# EAGLE design Line Tracer SET (EAGLE 7.6.0)
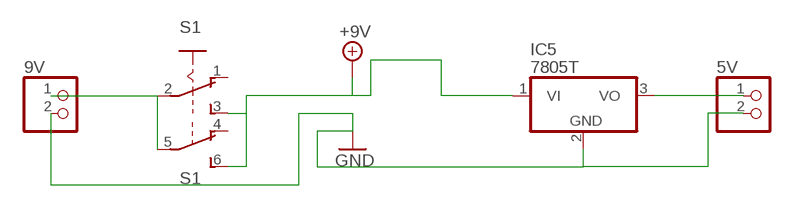
[diagram p0: schematic, sheet 1, part 1 of 2]
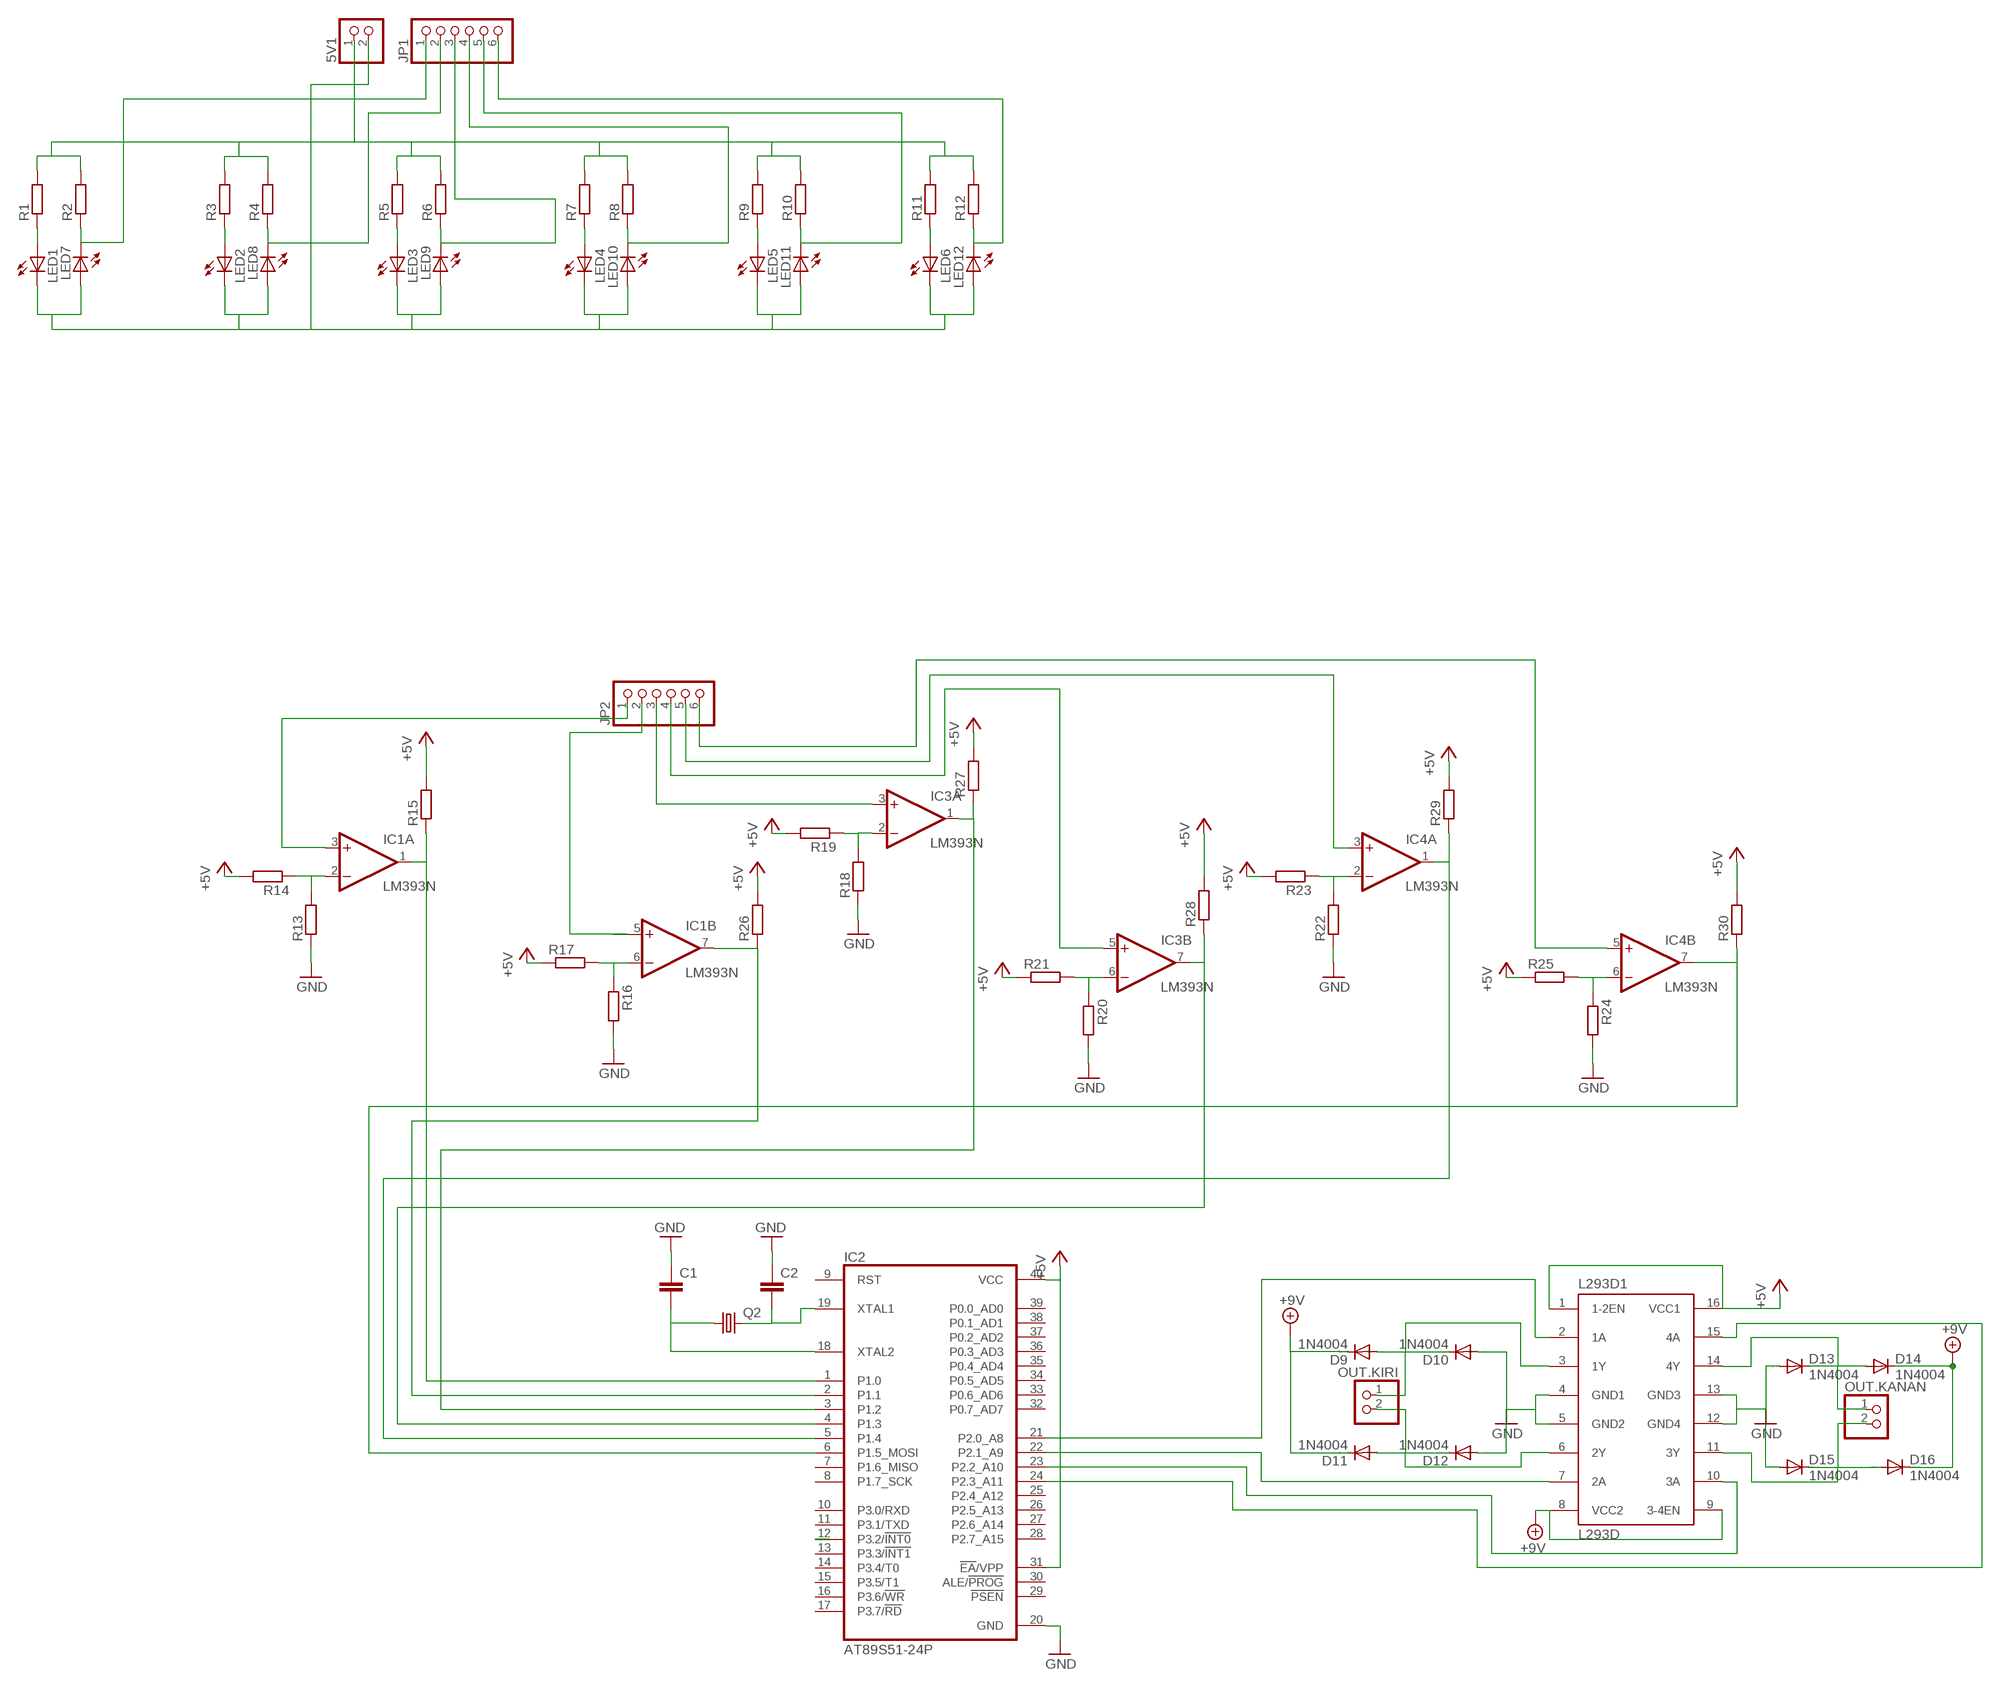
[diagram p1: schematic, sheet 1, part 2 of 2]

## Parts
5V  PINHD-1X2  [1X02]
5V1  PINHD-1X2  [1X02]
9V  PINHD-1X2  [1X02]
C1  C-EU025-024X044  [C025-024X044]
C2  C-EU025-024X044  [C025-024X044]
D9  1N4004  [DO41-10]
D10  1N4004  [DO41-10]
D11  1N4004  [DO41-10]
D12  1N4004  [DO41-10]
D13  1N4004  [DO41-10]
D14  1N4004  [DO41-10]
D15  1N4004  [DO41-10]
D16  1N4004  [DO41-10]
IC1  LM393N  [DIL08]
IC2  AT89S51-24P  [DIL40]
IC3  LM393N  [DIL08]
IC4  LM393N  [DIL08]
IC5  7805T  [TO220H]
JP1  PINHD-1X6  [1X06]
JP2  PINHD-1X6  [1X06]
L293D1  L293D  [DIL16]
LED1  LED3MM  [LED3MM]
LED2  LED3MM  [LED3MM]
LED3  LED3MM  [LED3MM]
LED4  LED3MM  [LED3MM]
LED5  LED3MM  [LED3MM]
LED6  LED3MM  [LED3MM]
LED7  LED3MM  [LED3MM]
LED8  LED3MM  [LED3MM]
LED9  LED3MM  [LED3MM]
LED10  LED3MM  [LED3MM]
LED11  LED3MM  [LED3MM]
LED12  LED3MM  [LED3MM]
OUT.KANAN  PINHD-1X2  [1X02]
OUT.KIRI  PINHD-1X2  [1X02]
Q2  CRYSTALHC49S  [HC49/S]
R1  R-EU_0207/10  [0207/10]
R2  R-EU_0207/10  [0207/10]
R3  R-EU_0207/10  [0207/10]
R4  R-EU_0207/10  [0207/10]
R5  R-EU_0207/10  [0207/10]
R6  R-EU_0207/10  [0207/10]
R7  R-EU_0207/10  [0207/10]
R8  R-EU_0207/10  [0207/10]
R9  R-EU_0207/10  [0207/10]
R10  R-EU_0207/10  [0207/10]
R11  R-EU_0207/10  [0207/10]
R12  R-EU_0207/10  [0207/10]
R13  R-EU_0207/10  [0207/10]
R14  R-EU_0207/10  [0207/10]
R15  R-EU_0207/10  [0207/10]
R16  R-EU_0207/10  [0207/10]
R17  R-EU_0207/10  [0207/10]
R18  R-EU_0207/10  [0207/10]
R19  R-EU_0207/10  [0207/10]
R20  R-EU_0207/10  [0207/10]
R21  R-EU_0207/10  [0207/10]
R22  R-EU_0207/10  [0207/10]
R23  R-EU_0207/10  [0207/10]
R24  R-EU_0207/10  [0207/10]
R25  R-EU_0207/10  [0207/10]
R26  R-EU_0207/10  [0207/10]
R27  R-EU_0207/10  [0207/10]
R28  R-EU_0207/10  [0207/10]
R29  R-EU_0207/10  [0207/10]
R30  R-EU_0207/10  [0207/10]
S1  A68-A31  [A68-A31]

## Nets
5V: 5V1.1 R1.2 R2.2 R3.2 R4.2 R5.2 R6.2 R7.2 R8.2 R9.2 R10.2 R11.2 R12.2
+5V: IC2.31(!EA!/VPP) IC2.40(VCC) L293D1.1(1-2EN) L293D1.16(VCC1) R14.2 R15.2 R17.1 R19.2 R21.1 R23.2 R25.1 R26.2 R27.2 R28.2 R29.2 R30.2
+9V: D9.C D11.C D14.C D16.C IC5.1(VI) L293D1.8(VCC2) L293D1.9(3-4EN) S1.3(A:S) S1.6(B:S)
GND: 5V.2 9V.2 C1.1 C2.1 D10.A D12.A D13.A D15.A IC2.20(GND) IC5.2(GND) L293D1.4(GND1) L293D1.5(GND2) L293D1.12(GND4) L293D1.13(GND3) R13.1 R16.2 R18.1 R20.2 R22.1 R24.2
GNDS: 5V1.2 LED1.K(C) LED2.K(C) LED3.K(C) LED4.K(C) LED5.K(C) LED6.K(C) LED7.A LED8.A LED9.A LED10.A LED11.A LED12.A
N$1: IC3.3(A:+IN) JP2.3
N$2: LED3.A R5.1
N$3: IC1.2(A:-IN) R13.2 R14.1
N$4: LED4.A R7.1
N$5: IC3.5(B:+IN) JP2.4
N$6: LED5.A R9.1
N$7: JP1.5 LED11.K(C) R10.1
N$8: LED6.A R11.1
N$9: IC4.5(B:+IN) JP2.6
N$10: LED1.A R1.1
N$11: JP1.2 LED8.K(C) R4.1
N$12: LED2.A R3.1
N$13: IC1.6(B:-IN) R16.1 R17.2
N$14: C2.2 IC2.19(XTAL1) Q2.2
N$15: JP1.3 LED9.K(C) R6.1
N$16: C1.2 IC2.18(XTAL2) Q2.1
N$17: IC3.2(A:-IN) R18.2 R19.1
N$18: IC3.6(B:-IN) R20.1 R21.2
N$19: IC4.2(A:-IN) R22.2 R23.1
N$20: IC4.6(B:-IN) R24.1 R25.2
N$21: IC2.12(P3.2/!INT0)
N$22: IC2.21(P2.0_A8) L293D1.2(1A)
N$23: D11.A D12.C L293D1.6(2Y) OUT.KIRI.2
N$24: IC2.3(P1.2) IC3.1(A:OUT) R27.1
N$25: D15.C D16.A L293D1.11(3Y) OUT.KANAN.2
N$26: D13.C D14.A L293D1.14(4Y) OUT.KANAN.1
N$27: IC2.22(P2.1_A9) L293D1.7(2A)
N$28: IC2.23(P2.2_A10) L293D1.10(3A)
N$29: IC2.24(P2.3_A11) L293D1.15(4A)
N$30: IC1.1(A:OUT) IC2.1(P1.0) R15.1
N$31: D9.A D10.C L293D1.3(1Y) OUT.KIRI.1
N$32: IC2.5(P1.4) IC4.1(A:OUT) R29.1
N$33: IC2.4(P1.3) IC3.7(B:OUT) R28.1
N$34: IC2.6(P1.5_MOSI) IC4.7(B:OUT) R30.1
N$35: IC1.7(B:OUT) IC2.2(P1.1) R26.1
N$36: JP1.1 LED7.K(C) R2.1
N$37: IC1.5(B:+IN) JP2.2
N$38: JP1.4 LED10.K(C) R8.1
N$39: IC4.3(A:+IN) JP2.5
N$40: JP1.6 LED12.K(C) R12.1
N$43: 5V.1 IC5.3(VO)
N$44: 9V.1 S1.2(A:P) S1.5(B:P)
N$46: IC1.3(A:+IN) JP2.1
Unconnected: IC2.7(P1.6_MISO) IC2.8(P1.7_SCK) IC2.9(RST) IC2.10(P3.0/RXD) IC2.11(P3.1/TXD) IC2.13(P3.3/!INT1) IC2.14(P3.4/T0) IC2.15(P3.5/T1) IC2.16(P3.6/!WR) IC2.17(P3.7/!RD) IC2.25(P2.4_A12) IC2.26(P2.5_A13) IC2.27(P2.6_A14) IC2.28(P2.7_A15) IC2.29(!PSEN) IC2.30(ALE/!PROG) IC2.32(P0.7_AD7) IC2.33(P0.6_AD6) IC2.34(P0.5_AD5) IC2.35(P0.4_AD4) IC2.36(P0.3_AD3) IC2.37(P0.2_AD2) IC2.38(P0.1_AD1) IC2.39(P0.0_AD0) S1.1(A:O) S1.4(B:O)

## Power pins joined to a net without a drawn wire
V+: IC1.8(P:V+) IC3.8(P:V+) IC4.8(P:V+)
V-: IC1.4(P:V-) IC3.4(P:V-) IC4.4(P:V-)

## Library data of the parts
5V 5V1 9V OUT.KANAN OUT.KIRI = pinhead:PINHD-1X2: PIN HEADER
C1 C2 = resistor:C-EU: CAPACITOR, European symbol
D9-D16 = diode:1N4004: DIODE general purpose rectifier, 1 A
IC1 IC3 IC4 = linear:LM393: COMPARATOR
IC2 = atmel:AT89S51-*: 8-bit Microcontroller with 4K BytesIn-System Programmable Flash Source: http://www.atmel.com/dyn/resources/prod_documents/doc2487.pdf; MPN: AT89S51-24PU; OC_FARNELL: 1095739; OC_NEWARK: 96K6578
IC5 = linear:78*: Positive VOLTAGE REGULATOR Source: http://cache.national.com/ds/LM/LM78L05.pdf http://www.fairchildsemi.com/ds/LM/LM7805.pdf
JP1 JP2 = pinhead:PINHD-1X6: PIN HEADER
L293D1 = st-microelectronics:L293D: PUSH-PULL 4 CHANNEL DRIVER; MPN: L293D; OC_FARNELL: 9589619; OC_NEWARK: 56P8249
LED1-LED12 = led:LED: LED OSRAM: - CHIPLED LG R971, LG N971, LY N971, LG Q971, LY Q971, LO R971, LY R971 LH N974, LH R974 LS Q976, LO Q976, LY Q976 LO Q996 - Hyper CHIPLED LW Q18S LB Q993, LB Q99A, LB R99A - SideLED LS A670, LO A670, LY A670, LG A670, LP A670 LB A673, LV A673, LT A673, LW A673 LH A674 LY A675 LS A676, LA A676, LO A676, LY A676, LW A676 LS A679, LY A679, LG A679 - Hyper Micro SIDELED® LS Y876, LA Y876, LO Y876, LY Y876 LT Y87S - SmartLED LW L88C, LW L88S LB L89C, LB L89S, LG L890 LS L89K, LO L89K, LY L89K LS L896, LA L896, LO L896, LY L896 - TOPLED LS T670, LO T670, LY T670, LG T670, LP T670 LSG T670, LSP T670, LSY T670, LOP T670, LYG T670 LG T671, LOG T671, LSG T671 LB T673, LV T673, LT T673, LW T673 LH T674 LS T676, LA T676, LO T676, LY T676, LB T676, LH T676, LSB T676, LW T676 LB T67C, LV T67C, LT T67C, LS T67K, LO T67K, LY T67K, LW E67C LS E67B, LA E67B, LO E67B, LY E67B, LB E67C, LV E67C, LT E67C LW T67C LS T679, LY T679, LG T679 LS T770, LO T770, LY T770, LG T770, LP T770 LB T773, LV T773, LT T773, LW T773 LH T774 LS E675, LA E675, LY E675, LS T675 LS T776, LA T776, LO T776, LY T776, LB T776 LHGB T686 LT T68C, LB T68C - Hyper Mini TOPLED® LB M676 - Mini TOPLED Santana® LG M470 LS M47K, LO M47K, LY M47K Source: http://www.osram.convergy.de LUXEON: - LUMILED® LXK2-PW12-R00, LXK2-PW12-S00, LXK2-PW14-U00, LXK2-PW14-V00 LXK2-PM12-R00, LXK2-PM12-S00, LXK2-PM14-U00 LXK2-PE12-Q00, LXK2-PE12-R00, LXK2-PE12-S00, LXK2-PE14-T00, LXK2-PE14-U00 LXK2-PB12-K00, LXK2-PB12-L00, LXK2-PB12-M00, LXK2-PB14-N00, LXK2-PB14-P00, LXK2-PB14-Q00 LXK2-PR12-L00, LXK2-PR12-M00, LXK2-PR14-Q00, LXK2-PR14-R00 LXK2-PD12-Q00, LXK2-PD12-R00, LXK2-PD12-S00 LXK2-PH12-R00, LXK2-PH12-S00 LXK2-PL12-P00, LXK2-PL12-Q00, LXK2-PL12-R00 Source: www.luxeon.com KINGBRIGHT: KA-3528ASYC Source: www.kingbright.com
Q2 = crystal:CRYSTAL: CRYSTAL; OC_FARNELL: 1667008; OC_NEWARK: unknown
R1-R30 = resistor:R-EU_: RESISTOR, European symbol
S1 = switch:A68-A31: SLIDING SWITCH Siemens, distributor Buerklin, 11G766

## Board
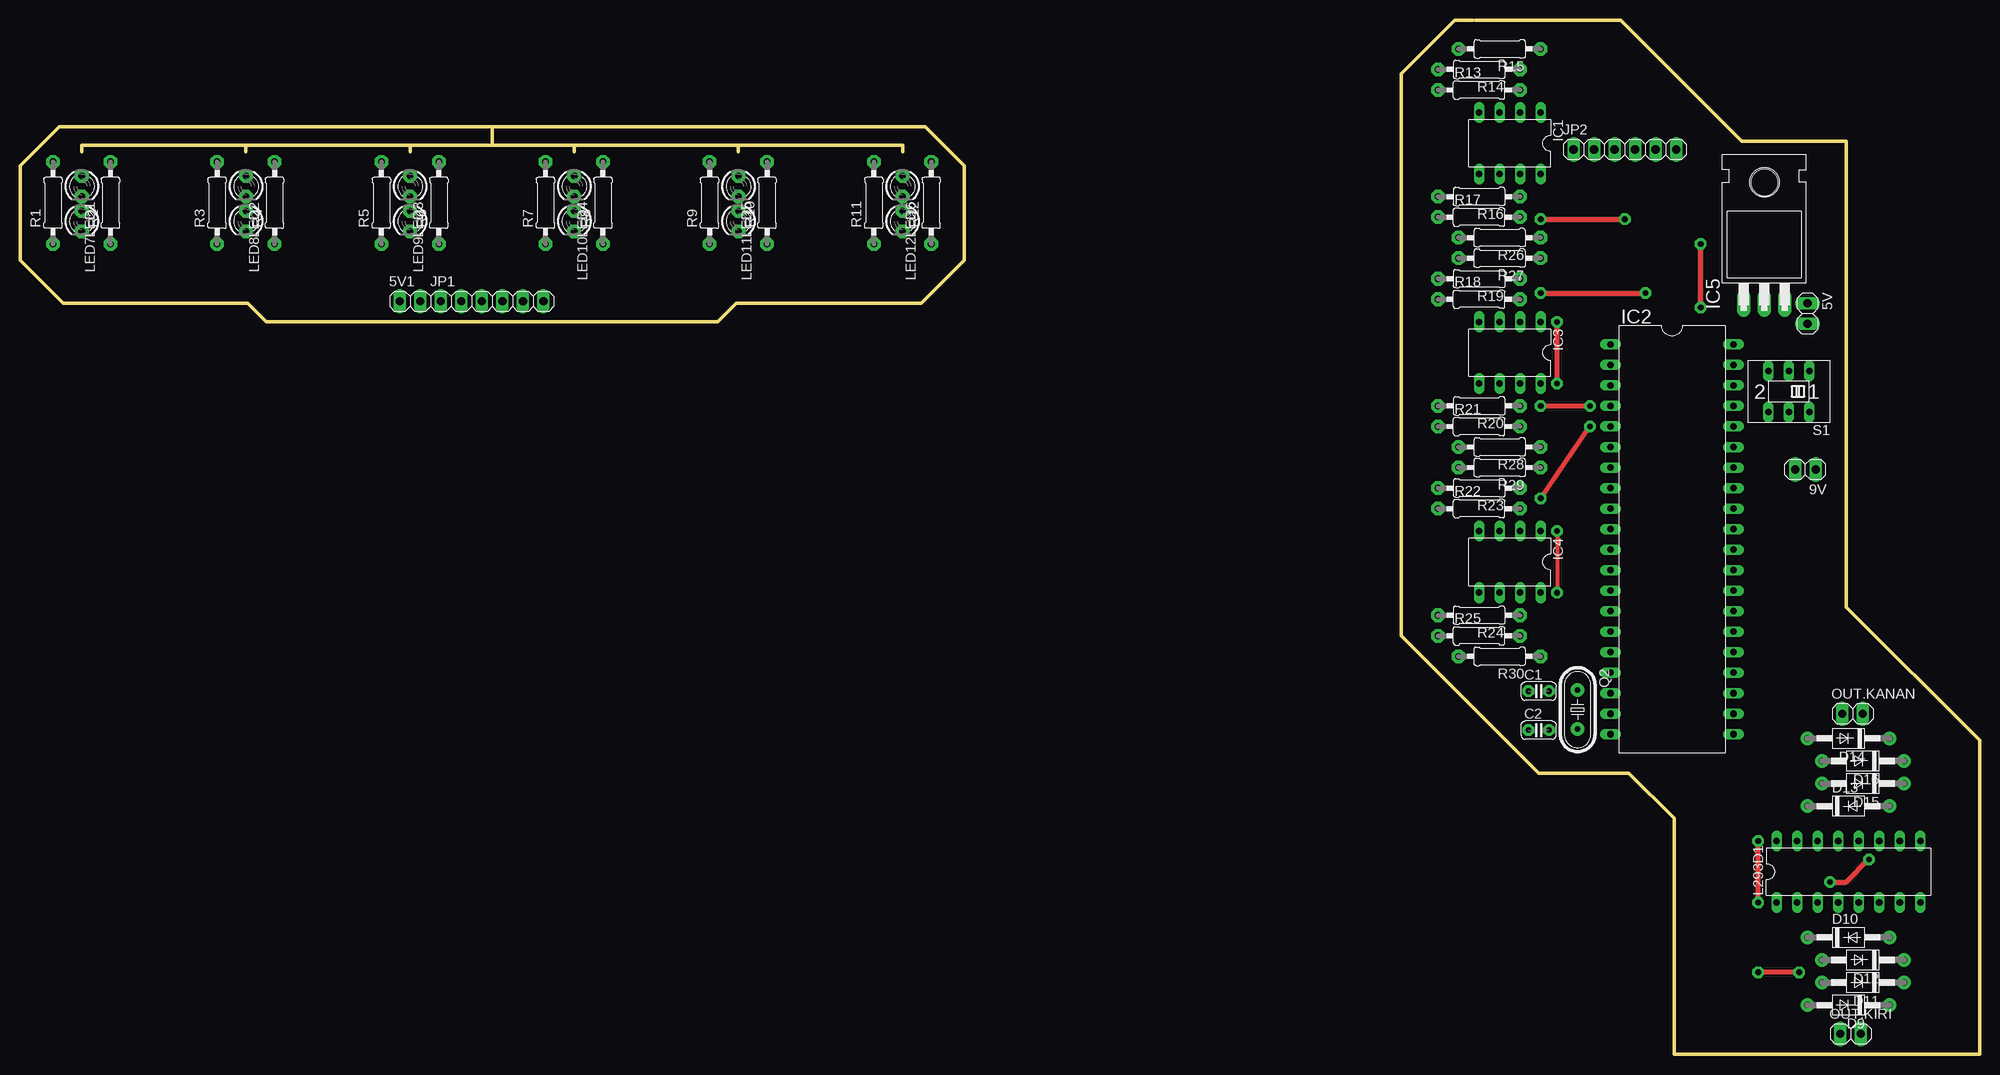
[diagram p2: board, top side]
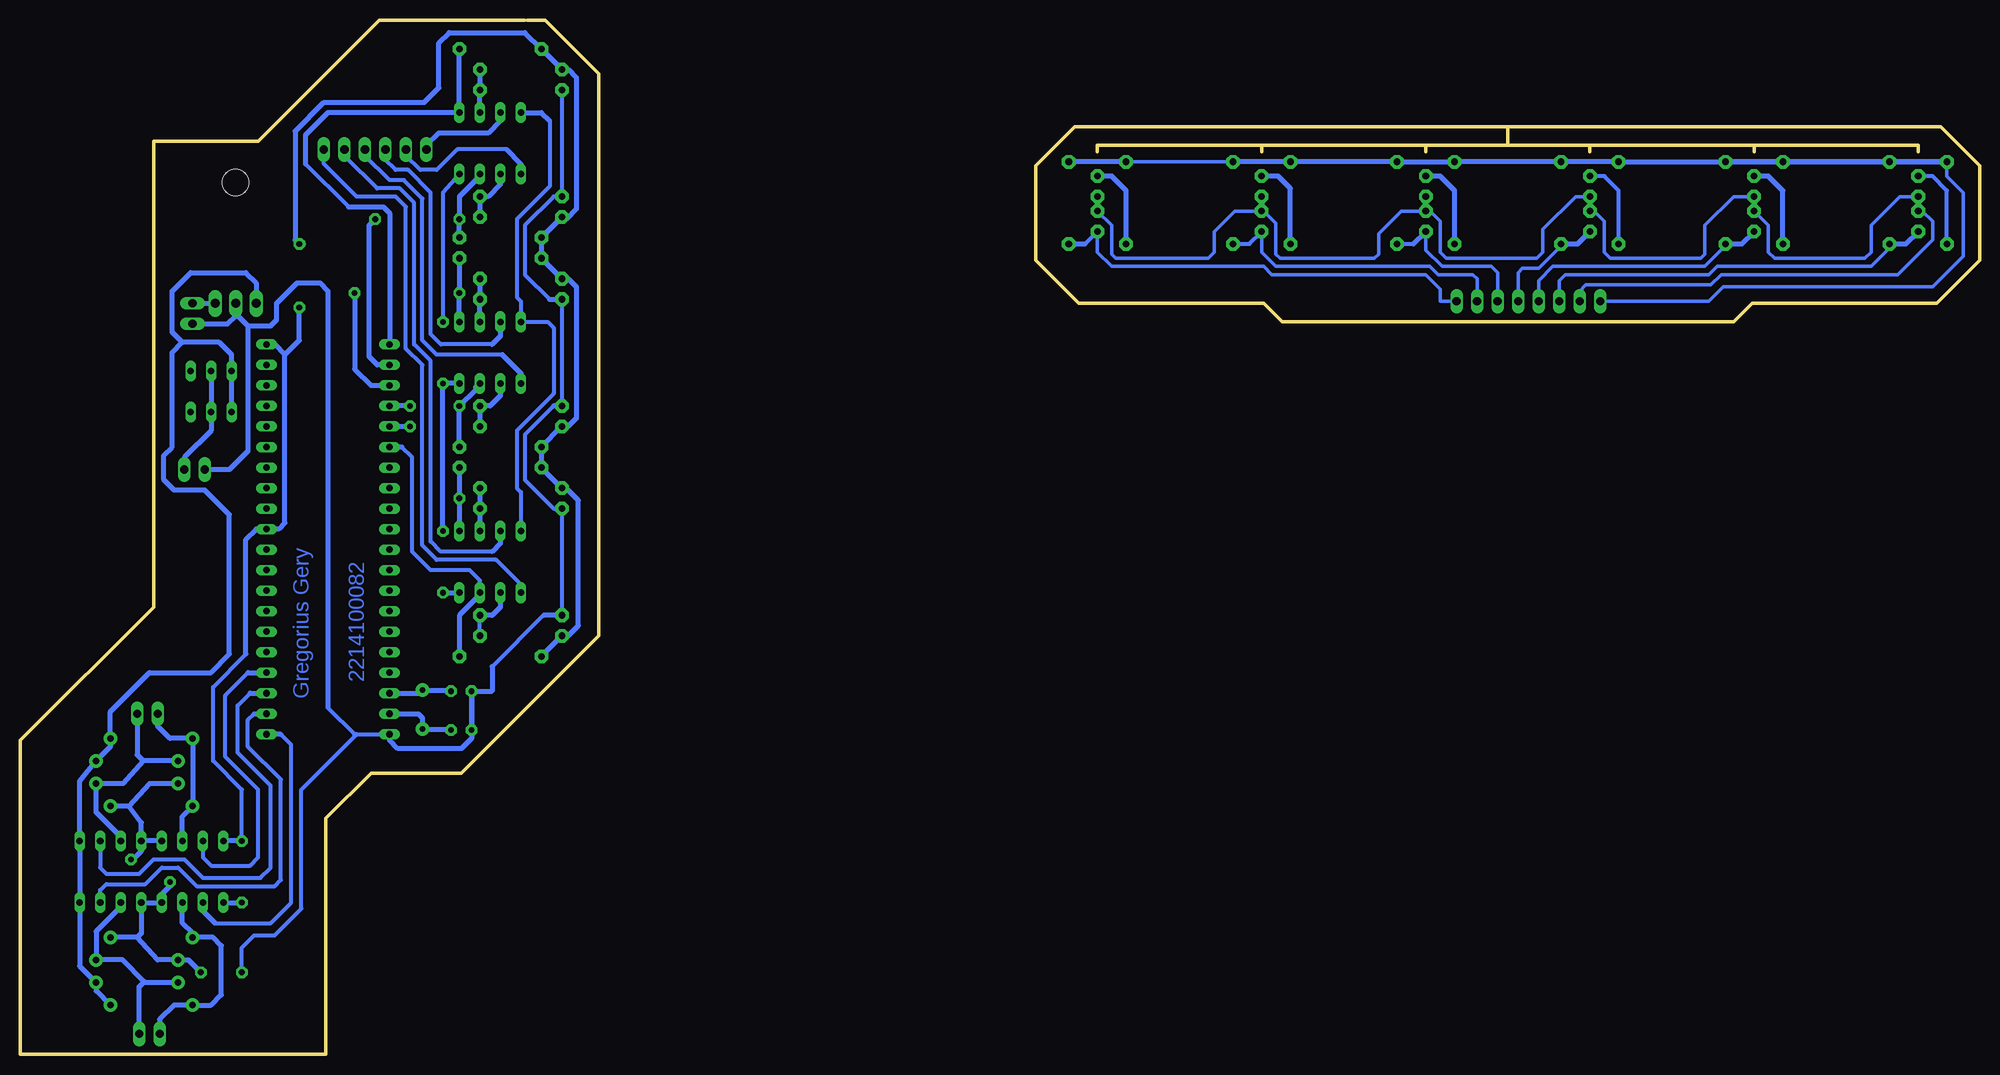
[diagram p3: board, bottom side, seen from below]

Size 242.57 x 128.02 mm. Coordinates in mm from the lower left corner, seen from the top.
Outline: 48.26,111.76 48.26,112.52
Outline: 48.26,112.52 58.42,112.52
Outline: 58.42,112.52 68.58,112.52
Outline: 68.58,112.52 68.58,111.76
Outline: 48.26,112.52 27.94,112.52
Outline: 88.9,112.52 68.58,112.52
Outline: 7.62,111.76 7.62,112.52 27.94,112.52
Outline: 27.94,112.52 27.94,111.76
Outline: 88.9,111.76 88.9,112.52
Outline: 88.9,112.52 109.22,112.52 109.22,111.76
Outline: 58.42,114.81 58.42,112.52
Outline: 180.09,128.02 198.12,128.02 213.11,113.03 226.06,113.03 226.06,55.37 242.57,38.86 242.57,0 204.72,0 204.72,29.21 199.14,34.8 187.96,34.8 170.94,51.82 170.94,121.41 177.55,128.02 179.83,128.02
Outline: 58.42,114.81 4.83,114.81 0,109.98 0,98.3 5.33,92.96 28.19,92.96 30.48,90.68 86.36,90.68 88.65,92.96 111.51,92.96 116.84,98.3 116.84,109.98 112.01,114.81 58.42,114.81
Copper layers (1*16): Top 0.035mm / dielectric 1.5mm / Bottom 0.035mm
Design rules "default *": minimum track width 10mil, minimum drill 24mil, track to track 15mil, track to pad 15mil, pad to pad 15mil, via to via 15mil, smd to smd 8mil, copper to edge 40mil, drill to drill 8mil, minimum pad ring 10mil, minimum via ring 8mil, stop-mask expansion 4mil, vias tented up to drill 0mil, thermal gap 10mil

### Footprints (pad centres in the part's own frame; a part is rotated, then mirrored left to right if it is on the bottom)
1X02 = drill 1.016 long: 1 -1.27,0; 2 1.27,0
C025-024X044 = drill 0.7 pad 1.422 octagon: 1 -1.27,0; 2 1.27,0
DO41-10 = drill 0.8 pad 1.676: A 5.08,0; C -5.08,0
DIL08 = drill 0.813 pad 1.27 long: 1 -3.81,-3.81; 2 -1.27,-3.81; 3 1.27,-3.81; 4 3.81,-3.81; 5 3.81,3.81; 6 1.27,3.81; 7 -1.27,3.81; 8 -3.81,3.81
DIL40 = drill 0.813 long: 1 -24.13,-7.62; 2 -21.59,-7.62; 3 -19.05,-7.62; 4 -16.51,-7.62; 5 -13.97,-7.62; 6 -11.43,-7.62; 7 -8.89,-7.62; 8 -6.35,-7.62; 9 -3.81,-7.62; 10 -1.27,-7.62; 11 1.27,-7.62; 12 3.81,-7.62; 13 6.35,-7.62; 14 8.89,-7.62; 15 11.43,-7.62; 16 13.97,-7.62; 17 16.51,-7.62; 18 19.05,-7.62; 19 21.59,-7.62; 20 24.13,-7.62; 21 24.13,7.62; 22 21.59,7.62; 23 19.05,7.62; 24 16.51,7.62; 25 13.97,7.62; 26 11.43,7.62; 27 8.89,7.62; 28 6.35,7.62; 29 3.81,7.62; 30 1.27,7.62; 31 -1.27,7.62; 32 -3.81,7.62; 33 -6.35,7.62; 34 -8.89,7.62; 35 -11.43,7.62; 36 -13.97,7.62; 37 -16.51,7.62; 38 -19.05,7.62; 39 -21.59,7.62; 40 -24.13,7.62
TO220H = drill 1.118 long: 1 -2.54,-10.16; 2 0,-10.16; 3 2.54,-10.16 | hole 3.302: 0,4.826
1X06 = drill 1.016 long: 1 -6.35,0; 2 -3.81,0; 3 -1.27,0; 4 1.27,0; 5 3.81,0; 6 6.35,0
DIL16 = drill 0.813 long: 1 -8.89,-3.81; 2 -6.35,-3.81; 3 -3.81,-3.81; 4 -1.27,-3.81; 5 1.27,-3.81; 6 3.81,-3.81; 7 6.35,-3.81; 8 8.89,-3.81; 9 8.89,3.81; 10 6.35,3.81; 11 3.81,3.81; 12 1.27,3.81; 13 -1.27,3.81; 14 -3.81,3.81; 15 -6.35,3.81; 16 -8.89,3.81
LED3MM = drill 0.813 pad 1.676 octagon: A -1.27,0; K 1.27,0
HC49/S = drill 0.7 pad 1.676: 1 -2.413,0; 2 2.413,0
0207/10 = drill 0.813 pad 1.676 octagon: 1 -5.08,0; 2 5.08,0
A68-A31 = drill 0.813 long: 1 -2.54,-2.54; 2 0,-2.54; 3 2.54,-2.54; 4 -2.54,2.54; 5 0,2.54; 6 2.54,2.54

### Placement (x,y rotation side)
5V  221.23,91.69 270 top
5V1  48.26,93.22 0 top
9V  220.98,72.39 180 top
C1  187.96,44.96 0 top
C2  187.96,40.13 0 top
D9  226.31,6.1 180 top
D10  226.31,14.48 0 top
D11  228.09,8.89 180 top
D12  228.09,11.68 180 top
D13  226.31,30.73 0 top
D14  226.31,39.12 180 top
D15  228.09,33.53 180 top
D16  228.09,36.32 180 top
IC1  184.4,112.78 180 top
IC2  204.47,63.75 270 top
IC3  184.4,86.87 180 top
IC4  184.4,60.96 180 top
IC5  215.9,103.12 0 top
JP1  58.42,93.22 0 top
JP2  198.63,112.01 0 top
L293D1  226.31,22.61 0 top
LED1  7.62,107.44 270 top
LED2  27.94,107.44 270 top
LED3  48.26,107.44 270 top
LED4  68.58,107.44 270 top
LED5  88.9,107.44 270 top
LED6  109.22,107.44 270 top
LED7  7.62,103.12 270 top
LED8  27.94,103.12 270 top
LED9  48.26,103.12 270 top
LED10  68.58,103.12 270 top
LED11  88.9,103.12 270 top
LED12  109.22,103.12 270 top
OUT.KANAN  226.82,42.16 0 top
OUT.KIRI  226.57,2.54 0 top
Q2  192.79,42.67 270 top
R1  4.06,105.41 90 top
R2  11.18,105.41 90 top
R3  24.38,105.41 90 top
R4  31.5,105.41 90 top
R5  44.7,105.41 90 top
R6  51.82,105.41 90 top
R7  65.02,105.41 90 top
R8  72.14,105.41 90 top
R9  85.34,105.41 90 top
R10  92.46,105.41 90 top
R11  105.66,105.41 90 top
R12  112.78,105.41 90 top
R13  180.59,119.38 0 top
R14  180.59,121.92 180 top
R15  183.13,124.46 180 top
R16  180.59,106.17 180 top
R17  180.59,103.63 0 top
R18  180.59,93.47 0 top
R19  180.59,96.01 180 top
R20  180.59,80.26 180 top
R21  180.59,77.72 0 top
R22  180.59,67.56 0 top
R23  180.59,70.1 180 top
R24  180.59,54.36 180 top
R25  180.59,51.82 0 top
R26  183.13,101.09 180 top
R27  183.13,98.55 180 top
R28  183.13,75.18 180 top
R29  183.13,72.64 180 top
R30  183.13,49.28 180 top
S1  218.95,82.04 180 top

### Tracks (layer width: path | path; a pad name or v marks a point on that pad's centre or on a via)
5V
  Bottom 0.406: R10.2 R11.2 | R6.2 R1.2 4.06,108.71 2.03,106.68 2.03,98.81 5.84,95 31.75,95 33.53,93.22 5V1.1
  Bottom 0.61: R4.2 R3.2 R2.2 R1.2 R4.2 | R10.2 R9.2 R8.2 R7.2 R6.2 R5.2 R4.2 | R11.2 R12.2
+5V  (via drill 0.7 pad 1.42)
  Top 0.61: v215.14,18.8 v215.14,26.42 | v208.03,92.46 v208.03,100.33
  Bottom 0.508: v215.14,26.42 215.14,32.77 218.69,36.32 218.69,45.47 214.63,49.53
  Bottom 0.61: IC2.40 211.07,87.88 209.8,86.61 | R30.2 R25.1 174.75,51.82 173.48,53.09 173.48,68.58 175.01,70.1 R23.2 R29.2 R28.2 R21.1 174.75,77.72 173.74,78.74 173.74,95 174.75,96.01 R19.2 R27.2 R26.2 R17.1 175.26,103.38 175.01,103.38 173.74,104.65 173.74,120.9 174.75,121.92 R14.2 R15.2 180.09,126.49 189.48,126.49 190.75,125.22 190.75,119.63 192.53,117.86 204.98,117.86 208.53,114.3 208.53,100.84 v208.03,100.33 207.52,100.33 | 209.8,86.61 209.8,65.79 210.57,65.02 IC2.31 213.36,65.02 214.63,63.75 214.63,49.53 | L293D1.1 v215.14,18.8 | v215.14,26.42 L293D1.16 | 209.8,86.61 208.03,88.39 v208.03,92.46
+9V
  Bottom 0.61: D9.C 233.17,7.87 D11.C 235.2,10.92 L293D1.8 L293D1.9 235.2,33.78 D16.C 231.39,38.1 D14.C 231.39,42.42 226.57,47.24 218.95,47.24 216.66,49.53 216.66,66.8 219.71,69.85 223.52,69.85 224.79,71.12 224.79,74.17 223.77,75.18 223.77,86.87 222.5,88.14 | IC5.1 213.36,95.5 214.63,96.77 221.49,96.77 223.77,94.49 223.77,89.41 222.5,88.14 | S1.6 S1.3 216.41,86.61 217.93,88.14 222.5,88.14
GND  (via drill 0.7 pad 1.42)
  Top 0.61: v224.03,21.34 226.06,21.34 v228.85,24.13 | v220.22,10.16 v215.14,10.16
  Bottom 0.508: R13.1 R16.2 176.53,106.17 180.09,102.62 180.09,96.52 177.04,93.47 | R18.1 R20.2 | R24.2 R22.1 176.53,67.56 180.09,71.12 180.09,76.71 176.53,80.26 | 177.8,54.36 184.15,48.01 | 204.47,42.93 201.17,39.62 | IC2.20 200.91,39.62 207.77,32.77 207.77,18.03 211.07,14.73 213.61,14.73 215.14,13.21 v215.14,10.16
  Bottom 0.61: C2.1 C1.1 | C1.1 186.69,39.12 187.96,37.85 195.83,37.85 196.85,38.86 IC2.20 | L293D1.13 L293D1.12 | L293D1.12 227.58,28.7 229.11,30.73 | 229.11,30.73 D13.A | D15.A 226.57,33.53 229.11,30.73 | 228.09,14.48 225.55,11.68 D12.A 221.74,11.68 v220.22,10.16 | 228.09,14.48 D10.A | 228.09,14.48 227.58,14.99 L293D1.5 L293D1.4 225.04,19.81 224.03,20.83 v224.03,21.34 | 177.04,93.47 R18.1 | R20.2 176.53,80.26 | v228.85,24.13 228.6,24.13 227.58,25.15 L293D1.12 | C1.1 184.15,44.96 184.15,48.01 | R24.2 177.8,54.36 | 5V.2 216.92,90.42 215.9,91.44 215.9,91.69 | 215.9,91.69 IC5.2 | 214.38,90.17 215.9,91.69 | 214.38,90.17 211.58,90.17 210.82,90.93 210.82,92.96 208.28,95.5 205.49,95.5 204.47,94.49 204.47,42.93 | 201.17,39.62 200.91,39.62 | 214.38,90.17 214.38,74.68 216.66,72.39 9V.2
GNDS
  Bottom 0.406: LED9.A 47.75,104.39 46.48,103.12 46.48,99.31 45.72,98.55 34.54,98.55 34.04,99.06 34.04,102.62 30.48,106.17 LED2.K | LED3.K 50.04,106.17 54.1,102.11 54.1,99.31 54.86,98.55 66.04,98.55 66.8,99.31 66.8,103.12 68.58,104.9 LED4.K | LED10.A 71.63,104.39 74.42,101.6 74.42,99.06 74.93,98.55 86.61,98.55 87.12,99.06 87.12,102.87 88.65,104.39 LED11.A 92.2,104.39 94.74,101.85 94.74,99.31 95.5,98.55 106.93,98.55 107.44,99.06 107.44,102.62 LED12.A | LED8.A 26.16,102.62 26.16,99.31 25.4,98.55 14.22,98.55 13.46,99.31 13.46,102.62 9.91,106.17 LED1.K | LED7.A 7.11,104.39 5.84,103.12 5.84,100.84 10.16,96.52 32,96.52 33.27,95.25 48.77,95.25 49.53,94.49 5V1.2
  Bottom 0.61: LED7.A LED1.K | LED2.K LED8.A | LED3.K LED9.A | LED10.A LED4.K | LED5.K LED11.A | LED6.K LED12.A
N$1
  Bottom 0.508: 184.15,87.88 190.5,87.88 191.77,89.15 191.77,106.68 194.56,109.47 196.09,109.47 197.36,110.74 JP2.3
  Bottom 0.61: IC3.3 183.13,88.9 184.15,87.88
N$2
  Bottom 0.508: R5.1 44.7,106.93 46.48,108.71 LED3.A
N$3
  Bottom 0.61: R14.1 R13.2 IC1.2
N$4
  Bottom 0.61: R7.1 65.02,106.93 66.8,108.71 LED4.A
N$5
  Bottom 0.508: 182.88,86.61 191.01,86.61 192.79,88.39 192.79,105.92 195.07,108.2 196.85,108.2 199.9,111.25 JP2.4
  Bottom 0.61: IC3.5 180.59,84.33 182.88,86.61
N$6
  Bottom 0.61: R9.1 85.34,107.19 86.87,108.71 LED5.A
N$7
  Bottom 0.406: LED11.K 88.9,99.31 87.12,97.54 68.07,97.54 67.06,96.52 62.74,96.52 62.23,96.01 JP1.5
  Bottom 0.508: R10.1 90.42,100.33 LED11.K
N$8
  Bottom 0.61: R11.1 105.66,106.93 107.44,108.71 LED6.A
N$9
  Bottom 0.508: IC4.5 180.59,58.17 183.64,61.21 191.01,61.21 192.79,62.99 192.79,85.34 194.82,87.38 194.82,104.9 196.09,106.17 200.91,106.17 204.98,110.24 JP2.6
N$10
  Bottom 0.508: R1.1 4.06,106.93 5.84,108.71 LED1.A
N$11
  Bottom 0.406: R4.1 31.5,100.08 34.04,97.54 52.83,97.54 54.61,95.76 JP1.2
  Bottom 0.61: R4.1 29.46,100.33 LED8.K
N$12
  Bottom 0.61: R3.1 24.38,106.93 26.16,108.71 LED2.A
N$13
  Bottom 0.61: IC1.6 183.13,107.7 184.66,106.17 R16.1 R17.2
N$14
  Bottom 0.61: IC2.19 193.29,42.16 192.79,41.66 Q2.2 189.36,40.26 C2.2
N$15
  Bottom 0.406: R6.1 51.82,100.08 54.61,97.28 56.64,97.28 57.15,96.77 JP1.3
  Bottom 0.61: R6.1 49.78,100.33 LED9.K
N$16
  Bottom 0.61: IC2.18 192.79,44.7 Q2.1 189.36,45.09 C1.2
N$17
  Bottom 0.61: R19.1 R18.2 IC3.2
N$18
  Bottom 0.61: IC3.6 183.13,81.53 184.4,80.26 R20.1 R21.2
N$19
  Bottom 0.61: R23.1 R22.2 IC4.2
N$20
  Bottom 0.508: R25.2 R24.1
  Bottom 0.61: IC4.6 183.13,55.37 184.15,54.36 R24.1
N$22
  Bottom 0.508: 218.44,16.26 211.58,16.26 209.04,18.8 209.04,38.35 210.31,39.62
  Bottom 0.61: L293D1.2 219.96,17.78 218.44,16.26 | 210.31,39.62 IC2.21
N$23
  Bottom 0.61: L293D1.6 230.12,18.29 233.17,15.24 D12.C 229.87,11.68 227.2,9.02 | D11.A 227.08,8.89 227.2,9.02 | OUT.KIRI.2 227.84,8.38 227.2,9.02
N$24  (via drill 0.7 pad 1.42)
  Top 0.61: v188.21,94.23 v201.17,94.23
  Bottom 0.61: R27.1 v188.21,94.23 IC3.1 | v201.17,94.23 201.17,84.84 199.14,82.8 IC2.3
N$25
  Bottom 0.61: D16.A 227.33,36.32 | 227.33,36.32 229.87,33.53 D15.C 233.17,29.97 230.12,26.92 L293D1.11 | OUT.KANAN.2 228.09,37.08 227.33,36.32
N$26
  Bottom 0.61: L293D1.14 222.5,29.46 D13.C D14.A 224.03,39.12 225.55,40.64 OUT.KANAN.1
N$27
  Bottom 0.508: L293D1.7 232.66,20.32 231.9,21.08 227.08,21.08 225.04,23.11 223.01,23.11 220.73,20.83 211.07,20.83 210.31,21.59 210.31,34.04 214.38,38.1 214.38,41.4 213.61,42.16
  Bottom 0.61: 213.61,42.16 IC2.22
N$28
  Bottom 0.508: L293D1.10 232.66,23.11 231.9,22.35 227.84,22.35 226.06,24.13 222.25,24.13 219.96,21.84 212.85,21.84 211.58,23.11 211.58,33.27 215.65,37.34 215.65,43.18 214.12,44.7
  Bottom 0.61: 214.12,44.7 IC2.23
N$29
  Bottom 0.508: L293D1.15 219.96,24.38 218.95,23.37 214.12,23.37 213.11,24.38 213.11,32.77 217.17,36.83 217.17,44.45 214.38,47.24
  Bottom 0.61: 214.38,47.24 IC2.24
N$30
  Bottom 0.508: 201.93,104.9 207.26,110.24
  Bottom 0.61: R15.1 IC1.1 204.47,116.59 207.26,113.79 207.26,110.24 | 201.93,104.9 197.61,104.9 196.85,104.14 IC2.1
N$31
  Bottom 0.61: L293D1.3 222.5,16.26 221.23,14.99 D10.C 218.69,14.48 217.68,13.46 217.68,7.37 218.95,6.1 D9.A 223.52,6.1 225.3,4.32 OUT.KIRI.1
N$32  (via drill 0.7 pad 1.42)
  Top 0.61: v188.21,68.83 v194.31,77.72
  Bottom 0.61: IC4.1 v188.21,68.83 R29.1 | IC2.5 v194.31,77.72
N$33  (via drill 0.7 pad 1.42)
  Top 0.61: v188.21,80.26 v194.31,80.26
  Bottom 0.61: R28.1 v188.21,80.26 186.18,82.3 186.18,82.55 IC3.7 | v194.31,80.26 IC2.4
N$34
  Bottom 0.508: IC4.7 185.67,58.67 186.94,59.94 191.77,59.94 194.06,62.23 194.06,73.91 195.33,75.18
  Bottom 0.61: IC4.7 185.67,56.9 188.21,54.36 R30.1 | 195.33,75.18 IC2.6
N$35  (via drill 0.7 pad 1.42)
  Top 0.61: v188.21,103.38 v198.63,103.38
  Bottom 0.61: IC1.7 185.67,108.71 188.21,106.17 v188.21,103.38 R26.1 | IC2.2 198.37,85.34 199.39,86.36 199.39,102.62 v198.63,103.38
N$36
  Bottom 0.406: R2.1 11.18,99.82 13.46,97.54 32.51,97.54 33.53,96.52 51.31,96.52 52.07,95.76 JP1.1
  Bottom 0.61: R2.1 9.14,100.33 LED7.K
N$37
  Bottom 0.508: 182.37,112.01 188.47,112.01 191.01,109.47 193.04,109.47 194.82,111.25 JP2.2
  Bottom 0.61: IC1.5 180.59,110.24 182.37,112.01
N$38
  Bottom 0.406: LED10.K 68.58,99.57 66.55,97.54 60.45,97.54 59.69,96.77 JP1.4
  Bottom 0.508: R8.1 70.1,100.33
  Bottom 0.61: 70.1,100.33 LED10.K
N$39
  Bottom 0.508: 184.15,62.23 190.5,62.23 191.77,63.5 191.77,85.85 193.8,87.88 193.8,105.41 195.58,107.19 198.37,107.19 202.18,111 202.18,111.76 JP2.5
  Bottom 0.61: IC4.3 183.13,63.25 184.15,62.23
N$40
  Bottom 0.406: LED12.K 109.22,99.31 107.44,97.54 88.65,97.54 87.63,96.52 68.58,96.52 66.8,94.74 66.8,93.22 JP1.6
  Bottom 0.508: 110.74,100.33 LED12.K
  Bottom 0.61: R12.1 110.74,100.33
N$43
  Bottom 0.61: 5V.1 IC5.3
N$44
  Bottom 0.61: S1.2 S1.5 218.95,77.22 222.25,73.91 9V.1
N$46
  Bottom 0.61: IC1.3 183.13,115.57 184.66,114.05 190.75,114.05 192.28,112.52 JP2.1
V+  (via drill 0.7 pad 1.42)
  Top 0.508: v190.25,64.77 v190.25,57.15
  Top 0.61: v190.25,83.06 v190.25,90.68
  Bottom 0.508: IC1.8 190.25,106.68 v190.25,90.68
  Bottom 0.61: IC3.8 v190.25,83.06 v190.25,64.77 | v190.25,57.15 IC4.8
V-
  Bottom 0.508: 177.04,115.57 177.04,107.44 181.1,103.38 181.1,93.73 180.59,93.22 IC3.4 177.29,90.68 176.53,89.92 176.53,81.79 181.1,77.22 181.1,70.1 180.59,69.6 IC4.4
  Bottom 0.61: IC1.4 178.05,116.59 177.04,115.57

### Text on the board
Bottom: Gregorius Gery | 2214100082